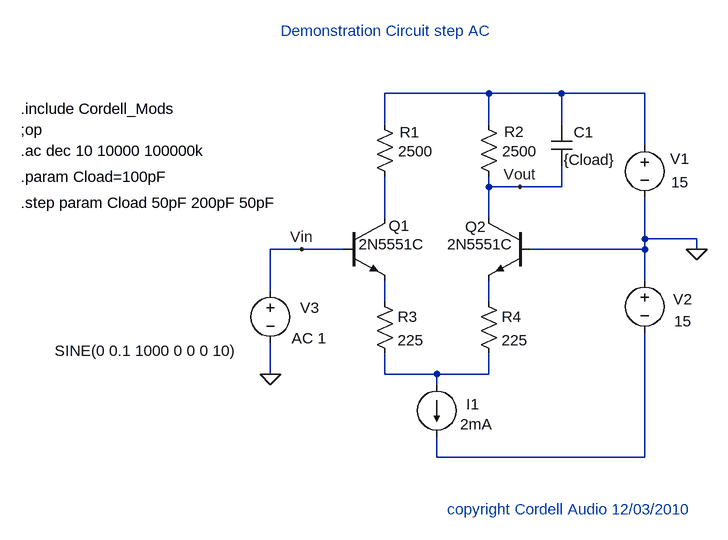
[diagram p0: schematic Demonstration_circuit_DC_Step_ac.asc]
Demonstration_circuit_DC_Step_ac.asc, the LTspice schematic file:
Version 4
SHEET 1 880 772
WIRE 160 64 0 64
WIRE 272 64 160 64
WIRE 400 64 272 64
WIRE 0 112 0 64
WIRE 160 112 160 64
WIRE 272 112 272 64
WIRE 400 144 400 64
WIRE 160 208 160 192
WIRE 208 208 160 208
WIRE 272 208 272 176
WIRE 272 208 208 208
WIRE 0 256 0 192
WIRE 160 256 160 208
WIRE 400 288 400 224
WIRE 480 288 400 288
WIRE -128 304 -176 304
WIRE -64 304 -128 304
WIRE 400 304 400 288
WIRE 400 304 224 304
WIRE 480 304 480 288
WIRE 400 352 400 304
WIRE -176 368 -176 304
WIRE 0 384 0 352
WIRE 160 384 160 352
WIRE -176 496 -176 448
WIRE 0 496 0 464
WIRE 80 496 0 496
WIRE 160 496 160 464
WIRE 160 496 80 496
WIRE 80 512 80 496
WIRE 80 624 80 592
WIRE 400 624 400 432
WIRE 400 624 80 624
FLAG 480 304 0
FLAG -176 496 0
FLAG -128 304 Vin
FLAG 208 208 Vout
SYMBOL res -16 96 R0
WINDOW 0 39 28 Left 0
WINDOW 3 37 57 Left 0
SYMATTR InstName R1
SYMATTR Value 2500
SYMBOL res 144 96 R0
WINDOW 0 40 27 Left 0
WINDOW 3 37 57 Left 0
SYMATTR InstName R2
SYMATTR Value 2500
SYMBOL voltage 400 128 R0
WINDOW 123 0 0 Left 0
WINDOW 39 0 0 Left 0
WINDOW 0 39 37 Left 0
WINDOW 3 41 73 Left 0
SYMATTR InstName V1
SYMATTR Value 15
SYMBOL voltage 400 336 R0
WINDOW 123 0 0 Left 0
WINDOW 39 0 0 Left 0
WINDOW 0 44 45 Left 0
WINDOW 3 45 79 Left 0
SYMATTR InstName V2
SYMATTR Value 15
SYMBOL npn -64 256 R0
WINDOW 3 24 40 Left 0
WINDOW 0 70 12 Left 0
SYMATTR Value 2N5551C
SYMATTR InstName Q1
SYMBOL npn 224 256 M0
WINDOW 3 26 40 Left 0
WINDOW 0 68 13 Left 0
SYMATTR Value 2N5551C
SYMATTR InstName Q2
SYMBOL res -16 368 R0
SYMATTR InstName R3
SYMATTR Value 225
SYMBOL res 144 368 R0
SYMATTR InstName R4
SYMATTR Value 225
SYMBOL current 80 512 R0
WINDOW 123 0 0 Left 0
WINDOW 39 0 0 Left 0
WINDOW 0 45 30 Left 0
WINDOW 3 36 61 Left 0
SYMATTR InstName I1
SYMATTR Value 2mA
SYMBOL voltage -176 352 R0
WINDOW 3 -332 108 Left 0
WINDOW 123 33 89 Left 0
WINDOW 39 0 0 Left 0
WINDOW 0 46 42 Left 0
SYMATTR Value SINE(0 0.1 1000 0 0 0 10)
SYMATTR Value2 AC 1
SYMATTR InstName V3
SYMBOL cap 256 112 R0
WINDOW 3 19 54 Left 0
WINDOW 0 35 12 Left 0
SYMATTR Value {Cload}
SYMATTR InstName C1
TEXT -560 120 Left 0 !;op
TEXT -560 152 Left 0 !.ac dec 10 10000 100000k
TEXT -160 -32 Left 0 ;Demonstration Circuit step AC
TEXT -560 232 Left 0 !.step param Cload 50pF 200pF 50pF
TEXT -560 192 Left 0 !.param Cload=100pF
TEXT -560 88 Left 0 !.include Cordell_Mods
TEXT 96 704 Left 0 ;copyright Cordell Audio 12/03/2010

The netlist it stands for:
* Demonstration_circuit_DC_Step_ac.asc
R1 N001 N002 2500
R2 N001 Vout 2500
V1 N001 0 15
V2 0 N006 15
Q1 N002 Vin N003 0 2N5551C
Q2 Vout 0 N004 0 2N5551C
R3 N003 N005 225
R4 N004 N005 225
I1 N005 N006 2mA
V3 Vin 0 SINE(0 0.1 1000 0 0 0 10) AC 1
C1 N001 Vout {Cload}
.model NPN NPN
.model PNP PNP
.lib standard.bjt
;op
.ac dec 10 10000 100000k
* Demonstration Circuit step AC
.step param Cload 50pF 200pF 50pF
.param Cload=100pF
.include Cordell_Mods
* copyright Cordell Audio 12/03/2010
.backanno
.end